# EAGLE design psu (EAGLE 7.4.0)
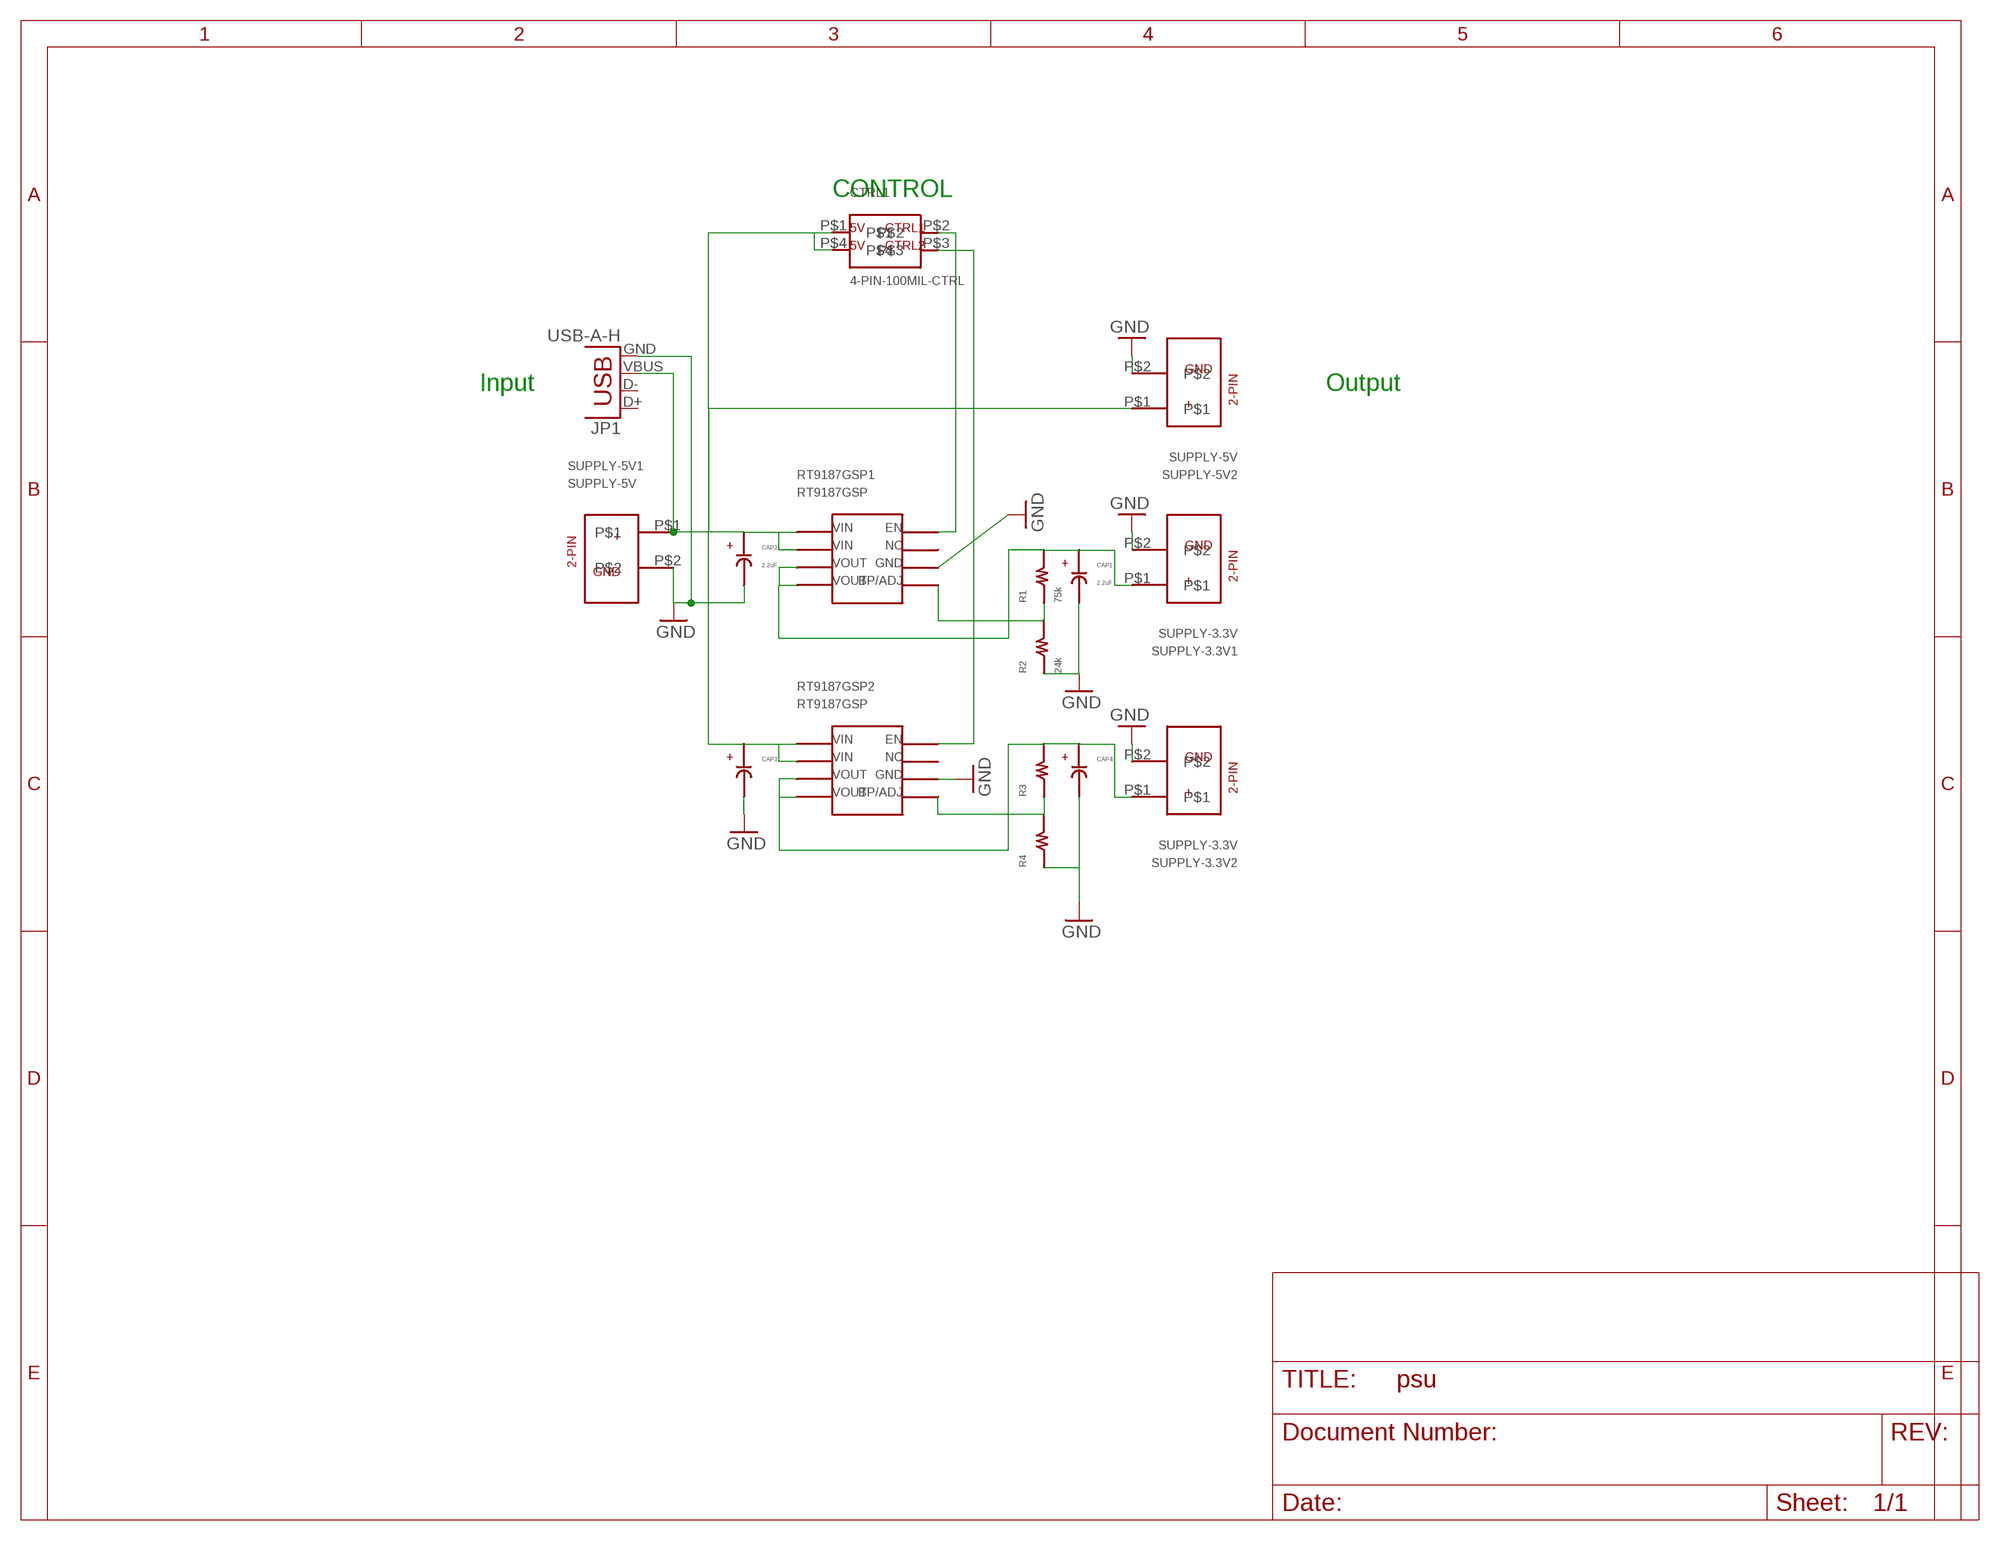
[diagram p0: schematic, sheet 1]

## Parts
CAP1  2.2uF  CAP-100MIL  [CAP-100MIL]
CAP2  2.2uF  CAP-100MIL  [CAP-100MIL]
CAP3  CAP-100MIL  [CAP-100MIL]
CAP4  CAP-100MIL  [CAP-100MIL]
CTRL1  4-PIN-100MIL-CTRL  [4-PIN-100MIL-CTRL]
JP1  USB-A-H  [USB-A-H]
R1  75k  RESISTOR-SMD-1206  [RESISTOR-SMD-1206]
R2  24k  RESISTOR-SMD-1206  [RESISTOR-SMD-1206]
R3  RESISTOR-SMD-1206  [RESISTOR-SMD-1206]
R4  RESISTOR-SMD-1206  [RESISTOR-SMD-1206]
RT9187GSP1  RT9187GSP  [SOP-8]
RT9187GSP2  RT9187GSP  [SOP-8]
SUPPLY-3.3V1  SUPPLY-3.3V  [2-PIN-100MIL-3.3V]
SUPPLY-3.3V2  SUPPLY-3.3V  [2-PIN-100MIL-3.3V]
SUPPLY-5V1  SUPPLY-5V  [2-PIN-100MIL-5V]
SUPPLY-5V2  SUPPLY-5V  [2-PIN-100MIL-5V]

## Nets
GND: CAP1.P$2 CAP2.P$2 CAP3.P$2 CAP4.P$2 JP1.GND R2.P$1 R4.P$1 RT9187GSP1.P$6 RT9187GSP2.P$6 SUPPLY-3.3V1.P$2 SUPPLY-3.3V2.P$2 SUPPLY-5V1.P$2 SUPPLY-5V2.P$2
N$4: R1.P$1 R2.P$2 RT9187GSP1.P$5
N$5: CTRL1.P$2 RT9187GSP1.P$8
N$6: CAP1.P$1 R1.P$2 RT9187GSP1.P$3 RT9187GSP1.P$4 SUPPLY-3.3V1.P$1
N$7: CAP4.P$1 R3.P$2 RT9187GSP2.P$3 RT9187GSP2.P$4 SUPPLY-3.3V2.P$1
N$8: R3.P$1 R4.P$2 RT9187GSP2.P$5
N$9: CTRL1.P$3 RT9187GSP2.P$8
N$14: CAP2.P$1 CAP3.P$1 CTRL1.P$1 CTRL1.P$4 JP1.VBUS RT9187GSP1.P$1 RT9187GSP1.P$2 RT9187GSP2.P$1 RT9187GSP2.P$2 SUPPLY-5V1.P$1 SUPPLY-5V2.P$1
Unconnected: JP1.D+ JP1.D- RT9187GSP1.P$7 RT9187GSP2.P$7

## Notes on the sheet
- CONTROL
- Input | Output

## Library data of the parts
CAP1-CAP4 = ncue_ee:CAP-100MIL
CTRL1 = ncue_ee:4-PIN-100MIL-CTRL
JP1 = SparkFun-Connectors:USB: USB Connectors USB-B-PTH is fully proven SKU : PRT-00139/CONN-08278 USB-miniB is fully proven SKU : PRT-00587 USB-A-PCB is untested. USB-A-H is throughly reviewed, but untested. Spark Fun Electronics SKU : PRT-00437 USB-B-SMT is throughly reviewed, but untested. Needs silkscreen touching up. USB-A-S has not been used/tested USB-MB-H has not been used/tested USB-MICROB has been used. CONN-09505; PROD_ID: CONN-08367
R1-R4 = ncue_ee:RESISTOR-SMD-1206
RT9187GSP1 RT9187GSP2 = ncue_ee:RT9187GSP
SUPPLY-3.3V1 SUPPLY-3.3V2 = ncue_ee:SUPPLY-3.3V
SUPPLY-5V1 SUPPLY-5V2 = ncue_ee:SUPPLY-5V

## Board
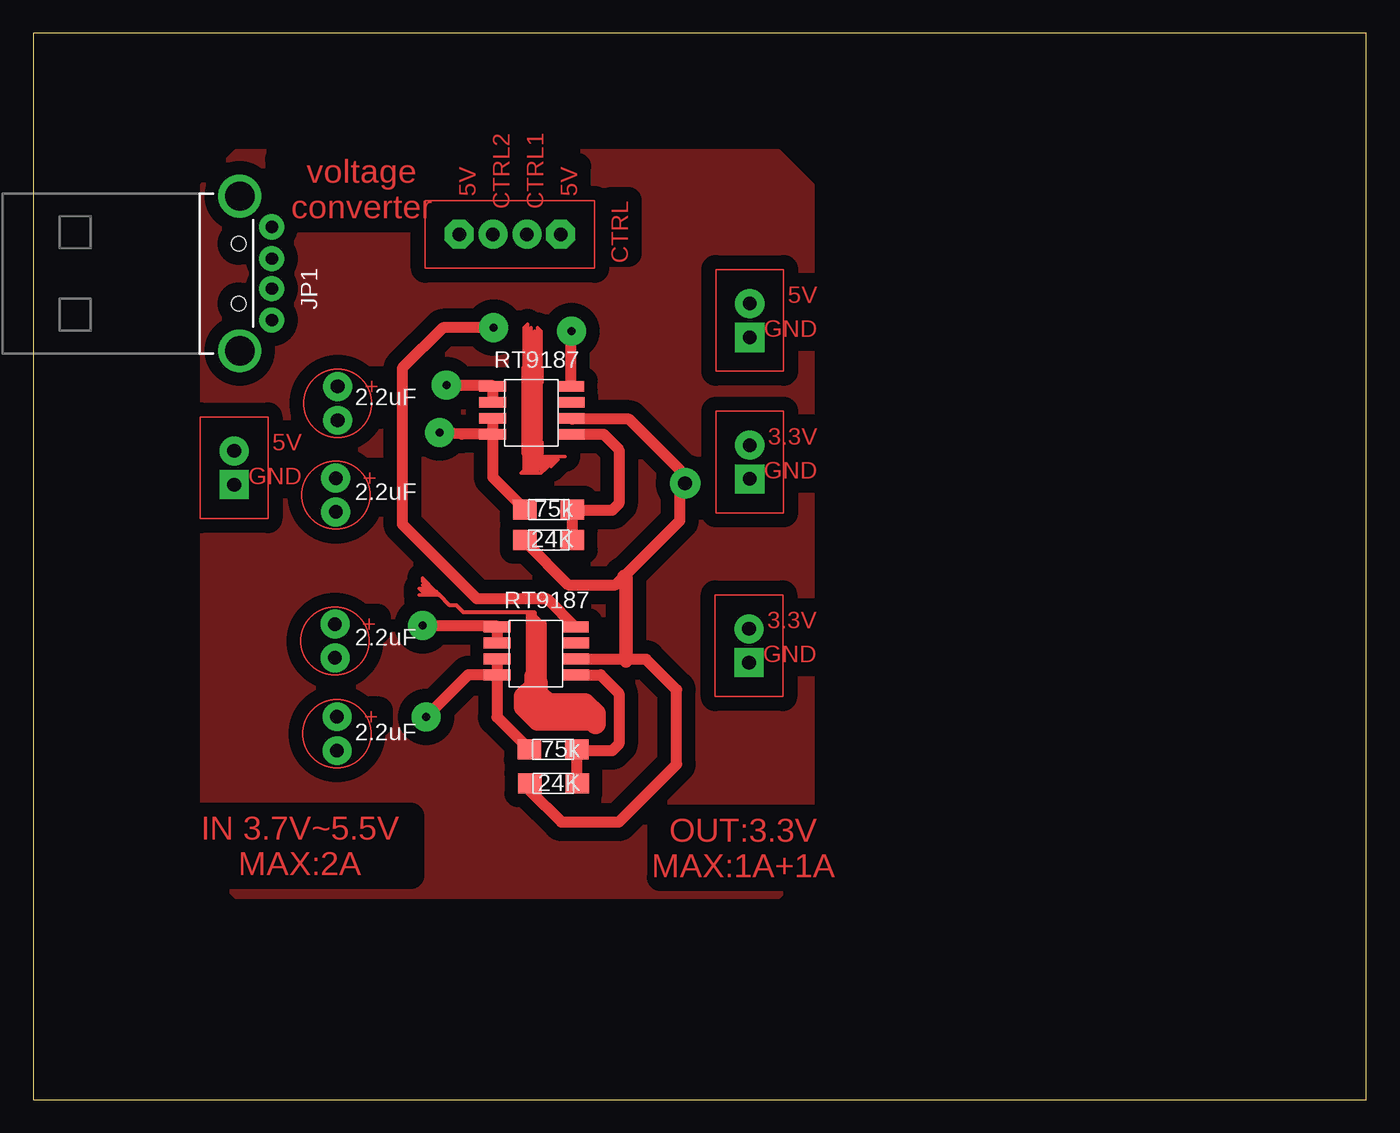
[diagram p1: board, top side]
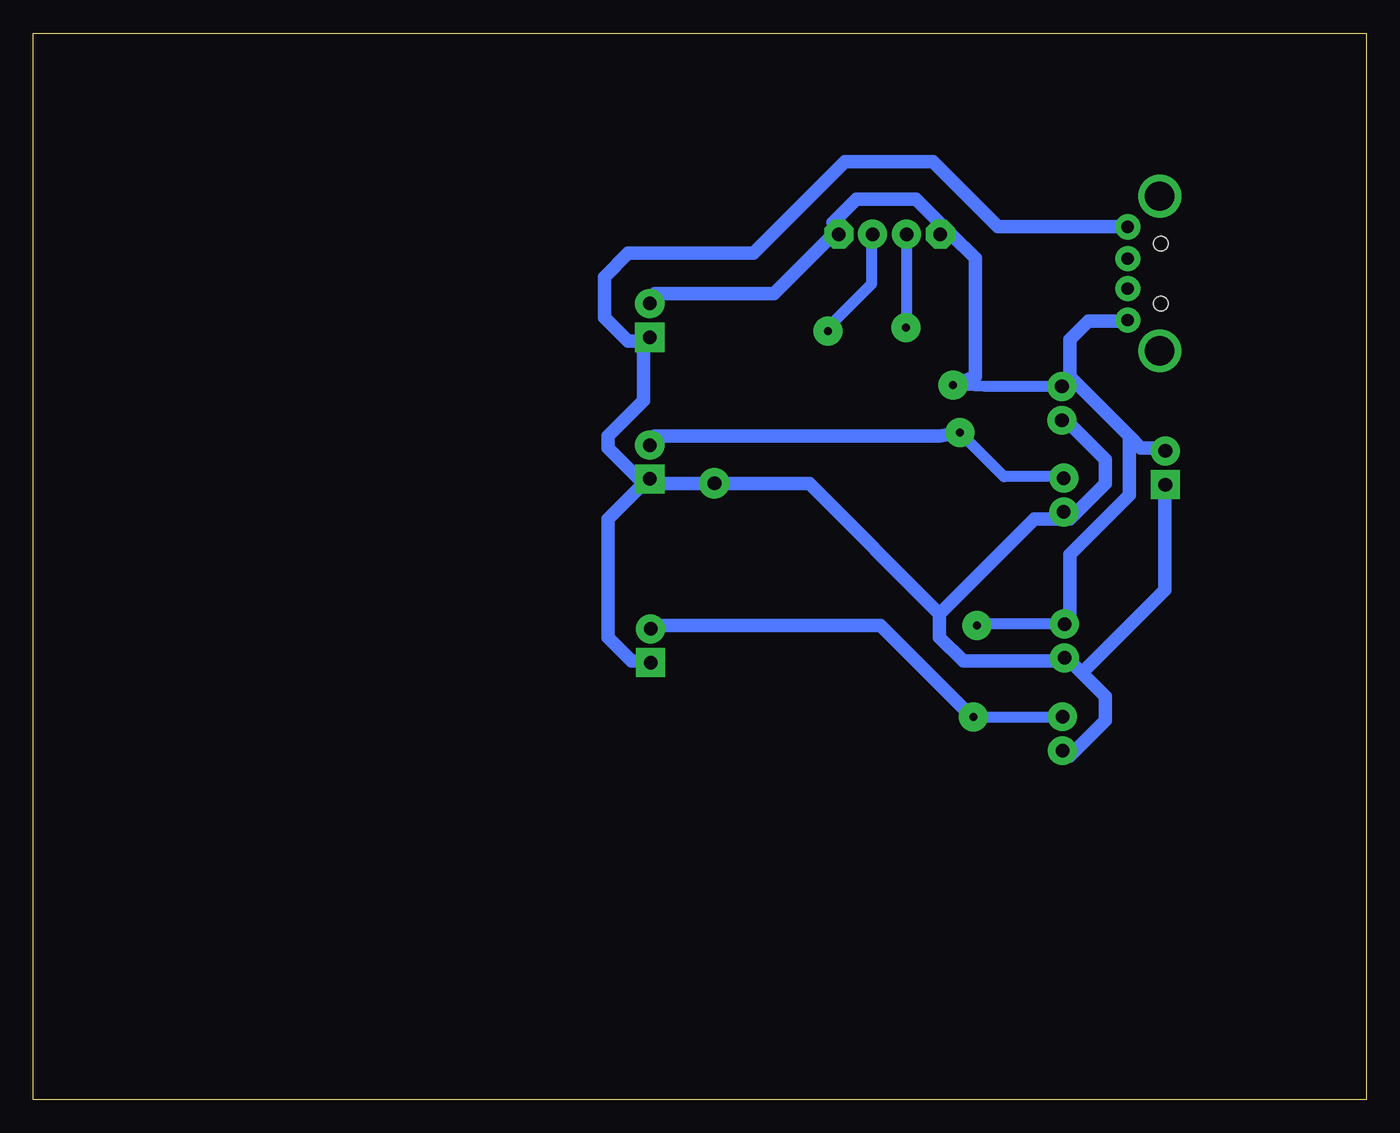
[diagram p2: board, bottom side, seen from below]

Size 100 x 80 mm. Coordinates in mm from the lower left corner, seen from the top.
Outline: 0,0 100,0 100,80 0,80 0,0
Copper layers (1*16): Top 0.035mm / dielectric 1.5mm / Bottom 0.035mm
Design rules "default *": minimum track width 40mil, minimum drill 40mil, track to track 40mil, track to pad 40mil, pad to pad 40mil, via to via 40mil, smd to smd 8mil, copper to edge 40mil, drill to drill 8mil, minimum pad ring 10mil, minimum via ring 8mil, stop-mask expansion 4mil, vias tented up to drill 0mil, thermal gap 10mil

### Footprints (pad centres in the part's own frame; a part is rotated, then mirrored left to right if it is on the bottom)
CAP-100MIL = drill 1.016 pad 2.159: P$1 0,0; P$2 2.54,0
4-PIN-100MIL-CTRL = drill 1.016 pad 2.184 octagon: P$1 2.54,-2.54; P$4 2.54,-10.16 | drill 1.016 pad 2.184: P$2 2.54,-5.08; P$3 2.54,-7.62
USB-A-H = drill 0.914 pad 1.88: D+ 2.4,1.127; D- 2.4,-1.127; GND 2.4,3.5; VBUS 2.4,-3.5 | drill 2.2: GND2 0,-5.8; GND3 0,5.8 | hole 1.1: -0.1,2.25; -0.1,-2.25
RESISTOR-SMD-1206 = smd 1.778 x 1.524: P$1 -0.254,-0.762; P$2 3.302,-0.762
SOP-8 = smd 2 x 0.8: P$1 -0.9,-0.5; P$2 -0.9,-1.7; P$3 -0.9,-2.9; P$4 -0.9,-4.1; P$5 5,-4.1; P$6 5,-2.9; P$7 5,-1.7; P$8 4.97,-0.5
2-PIN-100MIL-3.3V = drill 1.016 pad 2.184: P$1 0,0 | drill 1.016 pad 2.184 square: P$2 0,-2.54
2-PIN-100MIL-5V = drill 1.016 pad 2.184: P$1 0,0 | drill 1.016 pad 2.184 square: P$2 0,-2.54

### Placement (x,y rotation side)
CAP1  22.68,46.63 270 top
CAP2  22.83,53.5 270 top
CAP3  22.64,35.67 270 top
CAP4  22.79,28.72 270 top
CTRL1  42.11,67.46 270 top
JP1  15.49,61.98 0 top
R1  40.19,43.51 180 top
R2  37.14,42.74 0 top
R3  40.52,25.51 180 top
R4  37.5,24.48 0 top
RT9187GSP1  35.36,54.02 0 top
RT9187GSP2  35.69,35.96 0 top
SUPPLY-3.3V1  53.75,49.1 0 top
SUPPLY-3.3V2  53.69,35.32 0 top
SUPPLY-5V1  15.07,48.67 0 top
SUPPLY-5V2  53.75,59.73 0 top

### Tracks (layer width: path | path; a pad name or v marks a point on that pad's centre or on a via)
GND  (via drill 1.02 pad 2.29)
  Top 0.813: R4.P$1 37.25,23.21 39.62,20.83 43.94,20.83 48.26,25.15 48.26,30.73 45.97,33.02 44.45,33.02 40.73,33.02 RT9187GSP2.P$6 | R2.P$1 36.88,41.86 40.13,38.61 43.69,38.61 44.32,39.24 48.51,43.43 48.51,46.23 48.51,47.24 44.7,51.05 40.43,51.05 RT9187GSP1.P$6
  Top 1.016: 44.45,32.89 44.45,33.02 44.45,39.12 44.32,39.24 | v48.9,46.23 48.51,46.23
  Bottom 1.016: 54.23,46.23 56.9,43.56 56.9,34.67 55.12,32.89 54.23,32.89 SUPPLY-3.3V2.P$2 | 54.23,56.9 54.23,52.45 56.9,49.78 56.9,48.9 54.23,46.23 | 54.23,56.9 SUPPLY-5V2.P$2 | 54.23,46.23 SUPPLY-3.3V1.P$2 53.34,46.23 v48.9,46.23 41.78,46.23 32,36.45 | CAP2.P$2 22.23,50.67 19.56,48.01 19.56,46.23 22.23,43.56 CAP1.P$2 23.11,43.56 24.89,43.56 32,36.45 | 21.34,32 19.56,30.23 19.56,28.45 22.23,25.78 CAP4.P$2 | 21.34,32 22.23,32.89 CAP3.P$2 23.11,32.89 30.23,32.89 32,34.67 32,36.45 | 21.34,32 15.11,38.23 15.11,45.34 SUPPLY-5V1.P$2 | JP1.GND 27.63,65.48 32.51,70.36 39.12,70.36 45.97,63.5 55.37,63.5 57.15,61.72 57.15,58.67 55.37,56.9 54.23,56.9
N$1
  pour Top: 15.24,71.12 55.88,71.12 58.42,68.58 58.42,17.78 55.88,15.24 15.24,15.24 12.7,17.78 12.7,68.58
N$4
  Top 0.813: RT9187GSP1.P$5 42.79,49.92 43.94,48.77 43.94,44.7 43.43,44.2 40.51,44.2 R1.P$1 R2.P$2
N$5  (via drill 0.6 pad 2.18)
  Top 0.813: RT9187GSP1.P$8 40.33,57.6 v40.39,57.66
  Bottom 0.813: v40.39,57.66 40.39,57.91 37.08,61.21 37.08,64.87 CTRL1.P$2
N$6  (via drill 0.6 pad 2.18)
  Top 0.813: RT9187GSP1.P$3 RT9187GSP1.P$4 | RT9187GSP1.P$4 34.46,46.69 R1.P$2 | RT9187GSP1.P$4 32.14,49.92 v30.48,50.04
  Bottom 0.813: CAP1.P$1 22.79,46.74 27.18,46.74 v30.48,50.04
  Bottom 1.016: v30.48,50.04 32,49.78 53.34,49.78 SUPPLY-3.3V1.P$1
N$7  (via drill 0.6 pad 2.18)
  Top 0.813: RT9187GSP2.P$3 RT9187GSP2.P$4 | RT9187GSP2.P$4 34.79,28.7 R3.P$2 | RT9187GSP2.P$4 32.62,31.86 v29.46,28.7
  Bottom 0.813: v29.46,28.7 22.81,28.7 CAP4.P$1
  Bottom 1.016: SUPPLY-3.3V2.P$1 53.34,35.56 36.45,35.56 30.23,29.34 v29.46,28.7
N$8
  Top 0.813: RT9187GSP2.P$5 42.56,31.86 43.94,30.48 43.94,26.67 43.43,26.16 40.88,26.16 R3.P$1 40.77,23.75 R4.P$2
N$9  (via drill 0.6 pad 2.18)
  Top 0.813: v34.54,57.91 30.73,57.91 27.69,54.86 27.69,43.18 33.27,37.59 38.53,37.59 RT9187GSP2.P$8
  Bottom 0.813: CTRL1.P$3 34.49,57.97 v34.54,57.91
N$11
  Top 0.254: 36.83,54.86 36.83,55.37 | 36.83,55.37 37.08,55.12 37.08,56.39 | 37.08,56.39 37.34,56.39 | 37.34,56.39 37.34,56.13 | 37.34,56.13 37.34,55.12 37.59,55.12 37.59,56.39 | 37.59,56.39 37.85,56.39 | 37.85,55.37 37.85,55.12 38.1,55.12 | 36.83,55.37 36.83,57.91 37.08,58.17 37.08,56.39 | 37.08,56.39 37.34,56.13 | 37.34,56.39 37.34,56.64 | 37.34,57.91 37.34,56.64 | 37.34,56.64 37.59,56.39 | 37.59,56.39 37.59,56.64 | 37.59,57.66 37.59,56.64 | 37.59,56.64 37.85,56.39 | 37.85,56.39 37.85,57.91 38.1,57.66 38.1,55.12 | 37.85,56.39 37.85,55.37 | 37.85,55.37 38.1,55.12
  Top 0.406: 36.83,53.59 36.83,54.86 37.08,55.12 37.08,53.85 37.34,53.85 37.34,54.1 | 37.34,55.12 37.34,54.1 | 37.34,54.1 37.59,53.85 37.59,54.1 | 37.59,55.12 37.59,54.1 | 37.59,54.1 37.85,53.85 37.85,54.1 | 37.85,54.1 37.85,55.12 38.1,54.86 38.1,53.85 37.85,54.1
N$14  (via drill 0.6 pad 2.18)
  Top 0.813: RT9187GSP1.P$2 RT9187GSP1.P$1 34.39,53.59 v30.99,53.59 | RT9187GSP2.P$2 RT9187GSP2.P$1 34.69,35.56 v29.21,35.56
  Bottom 0.813: CAP2.P$1 28.61,53.5 v30.99,53.59 | CAP3.P$1 29.1,35.67 v29.21,35.56
  Bottom 1.016: 22.23,54.23 17.78,49.78 | 17.78,49.78 16.89,48.9 15.11,48.9 SUPPLY-5V1.P$1 | 22.23,54.23 CAP2.P$1 | SUPPLY-5V2.P$1 53.34,60.45 44.45,60.45 40.01,64.9 CTRL1.P$1 40.01,65.79 38.23,67.56 33.78,67.56 32,65.79 CTRL1.P$4 31.11,64.9 29.34,63.12 29.34,54.23 v30.99,53.59 | 17.78,49.78 17.78,45.34 22.23,40.89 22.23,36.45 CAP3.P$1 | 22.23,54.23 22.23,57.02 20.83,58.42 17.95,58.42 JP1.VBUS
N$23
  Top 0.406: 36.83,49.53 36.83,48.51 37.08,48.26 37.08,49.53 37.34,49.53 37.34,48.51 37.59,48.51 37.59,49.53 37.85,49.53 | 37.85,49.53 37.85,48.51 38.1,48.51 38.1,49.28 37.85,49.53
N$24
  Top 0.254: 30.23,38.1 29.21,39.12 29.21,38.86 29.97,38.1 | 29.46,38.1 29.21,38.1 28.96,38.35 29.46,38.35 | 29.46,38.35 29.21,38.61 | 29.46,38.35 29.97,37.85 | 29.97,37.85 29.21,37.85 | 29.21,37.85 28.96,37.85 | 29.97,37.85 30.23,37.85 | 30.48,37.85 30.23,37.85 | 30.23,37.85 29.97,38.1 | 29.97,38.1 29.46,38.1 | 29.46,38.1 29.21,37.85
  Top 0.305: 37.08,36.58 32.26,36.58 31.75,37.08 31.24,37.08 30.48,37.85 30.23,38.1 | 37.08,36.58 37.34,36.58 | 37.34,36.58 37.59,36.58 37.59,36.32 | 37.59,36.32 37.34,36.07 | 37.34,36.07 37.08,35.81 38.1,35.81 | 38.35,35.81 38.1,35.81 | 38.1,35.81 37.59,36.32 | 37.59,36.32 37.59,36.07 | 37.34,36.58 37.34,36.32 | 37.34,36.07 37.34,36.32 | 37.34,36.32 37.08,36.58 | 37.08,36.58 37.08,36.07
N$25
  Top 0.254: 36.83,48.26 36.83,47.24 37.08,46.99 37.08,47.5 | 37.08,47.5 37.59,46.99 37.59,48.01 37.34,48.26 | 37.34,48.26 37.34,48.01 | 37.34,46.99 37.34,48.01 | 37.34,48.01 37.59,48.26 | 37.59,48.26 37.59,47.5 37.85,47.24 37.85,47.5 | 37.85,48.26 37.85,47.5 | 37.85,47.5 38.1,47.24 38.1,47.5 | 38.1,48.01 38.1,47.5 | 38.1,47.5 38.35,47.24 38.35,48.01 | 38.35,48.01 38.1,48.26 | 38.1,48.26 37.59,48.26 | 37.59,48.26 37.34,48.26 | 37.34,48.26 37.08,48.01 37.08,47.5 | 37.08,47.5 36.58,46.99 38.1,46.99 38.61,47.5 38.61,47.75 39.12,47.75 | 39.12,47.75 38.86,47.5 38.35,48.01 | 39.12,47.75 39.37,48.01 38.1,48.01 | 38.1,48.01 38.1,48.26 | 39.88,48.26 38.1,48.26
N$29
  Top 1.524: 37.59,31.75 37.59,30.99 36.83,30.23 36.83,29.46 37.85,28.45 41.91,28.45 42.16,28.19 42.16,28.96 41.4,29.72 38.61,29.72 37.85,30.48 37.85,31.24

### Text on the board
Top: voltage / converter | IN 3.7V~5.5V / MAX:2A | OUT:3.3V / MAX:1A+1A
tPlace: RT9187 | 2.2uF | 2.2uF | 75k | 24K | RT9187 | 2.2uF | 2.2uF | 75k | 24K